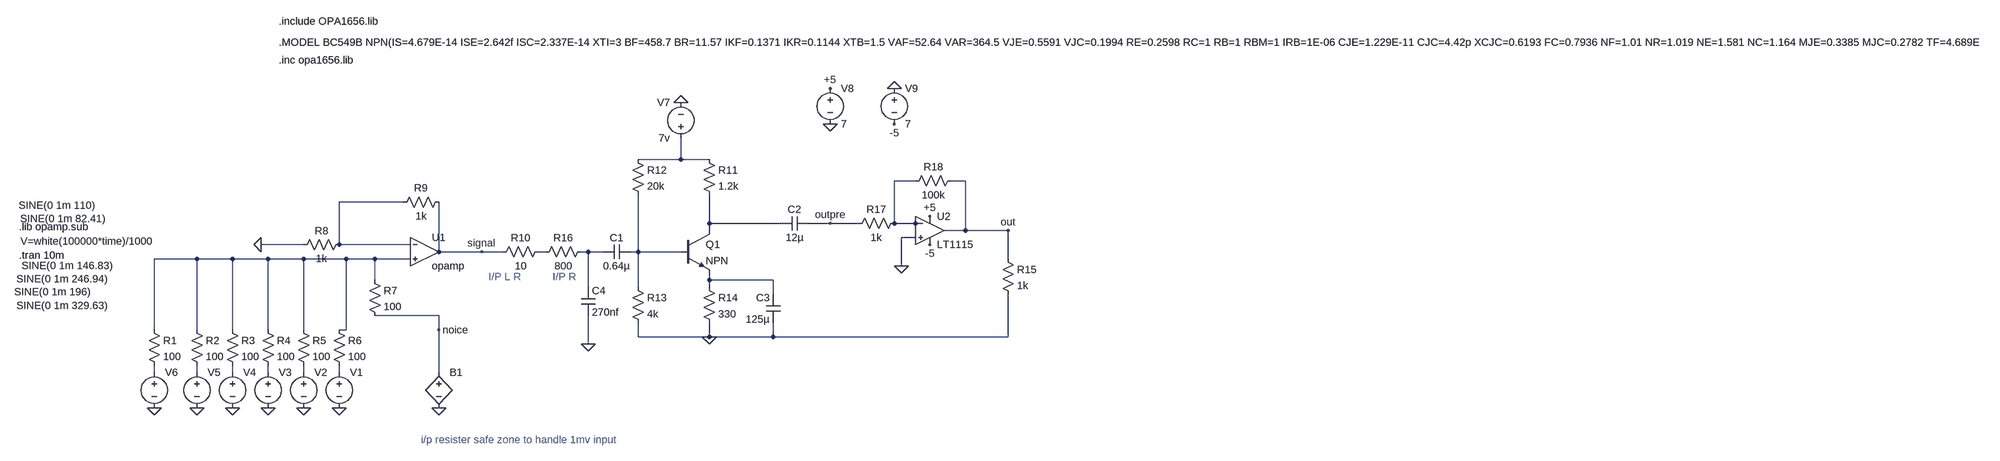
[diagram p0: schematic ADP.asc]
ADP.asc, the LTspice schematic file:
Version 4.1
SHEET 1 4832 680
WIRE 496 -320 496 -368
WIRE 496 -320 400 -320
WIRE 560 -320 496 -320
WIRE 1024 -272 976 -272
WIRE 1136 -272 1104 -272
WIRE -128 -224 -272 -224
WIRE 560 -176 560 -240
WIRE 720 -176 560 -176
WIRE 832 -176 784 -176
WIRE 896 -176 832 -176
WIRE 976 -176 976 -272
WIRE 1024 -176 976 -176
WIRE 1040 -176 1024 -176
WIRE 560 -160 560 -176
WIRE 1136 -160 1136 -272
WIRE 1136 -160 1088 -160
WIRE 1232 -160 1136 -160
WIRE 1024 -144 992 -144
WIRE -352 -128 -448 -128
WIRE -272 -128 -272 -224
WIRE -112 -128 -272 -128
WIRE -48 -112 -48 -224
WIRE 48 -112 -48 -112
WIRE 96 -112 48 -112
WIRE 192 -112 176 -112
WIRE 288 -112 272 -112
WIRE 320 -112 288 -112
WIRE 400 -112 400 -240
WIRE 400 -112 384 -112
WIRE 496 -112 400 -112
WIRE -592 -96 -688 -96
WIRE -512 -96 -592 -96
WIRE -432 -96 -512 -96
WIRE -352 -96 -432 -96
WIRE -256 -96 -352 -96
WIRE -192 -96 -256 -96
WIRE -112 -96 -192 -96
WIRE 1232 -96 1232 -160
WIRE 992 -80 992 -144
WIRE -192 -48 -192 -96
WIRE 560 -48 560 -64
WIRE 704 -48 560 -48
WIRE 288 -32 288 -112
WIRE 400 -32 400 -112
WIRE 560 -32 560 -48
WIRE 704 -16 704 -48
WIRE -48 32 -192 32
WIRE -688 64 -688 -96
WIRE -592 64 -592 -96
WIRE -512 64 -512 -96
WIRE -432 64 -432 -96
WIRE -352 64 -352 -96
WIRE -256 64 -256 -96
WIRE -256 64 -272 64
WIRE -48 64 -48 32
WIRE 400 80 400 48
WIRE 560 80 560 48
WIRE 560 80 400 80
WIRE 704 80 704 48
WIRE 704 80 560 80
WIRE 1232 80 1232 -16
WIRE 1232 80 704 80
WIRE 288 96 288 32
WIRE -688 160 -688 144
WIRE -592 160 -592 144
WIRE -512 160 -512 144
WIRE -432 160 -432 144
WIRE -352 160 -352 144
WIRE -272 160 -272 144
WIRE -48 160 -48 64
FLAG -48 240 0
FLAG -48 64 noice
FLAG -688 240 0
FLAG -592 240 0
FLAG -512 240 0
FLAG -432 240 0
FLAG -352 240 0
FLAG -272 240 0
FLAG -448 -128 0
FLAG 48 -112 signal
FLAG 496 -448 0
FLAG 560 80 0
FLAG 288 96 0
FLAG 832 -176 outpre
FLAG 992 -80 0
FLAG 832 -400 0
FLAG 976 -480 0
FLAG 832 -480 +5
FLAG 1056 -192 +5
FLAG 976 -400 -5
FLAG 1056 -128 -5
FLAG 1232 -160 out
SYMBOL bv -48 144 R0
WINDOW 3 -941 -280 Left 2
SYMATTR InstName B1
SYMATTR Value V=white(100000*time)/1000
SYMBOL voltage -272 144 R0
WINDOW 3 -718 -331 Left 2
WINDOW 123 0 0 Left 0
WINDOW 39 0 0 Left 0
SYMATTR InstName V1
SYMATTR Value SINE(0 1m 82.41)
SYMBOL voltage -352 144 R0
WINDOW 3 -641 -361 Left 2
WINDOW 123 0 0 Left 0
WINDOW 39 0 0 Left 0
SYMATTR InstName V2
SYMATTR Value SINE(0 1m 110)
SYMBOL voltage -432 144 R0
WINDOW 3 -554 -225 Left 2
WINDOW 123 0 0 Left 0
WINDOW 39 0 0 Left 0
SYMATTR InstName V3
SYMATTR Value SINE(0 1m 146.83)
SYMBOL voltage -512 144 R0
WINDOW 3 -491 -166 Left 2
WINDOW 123 0 0 Left 0
WINDOW 39 0 0 Left 0
SYMATTR InstName V4
SYMATTR Value SINE(0 1m 196)
SYMBOL voltage -592 144 R0
WINDOW 3 -406 -195 Left 2
WINDOW 123 0 0 Left 0
WINDOW 39 0 0 Left 0
SYMATTR InstName V5
SYMATTR Value SINE(0 1m 246.94)
SYMBOL voltage -688 144 R0
WINDOW 3 -310 -135 Left 2
WINDOW 123 0 0 Left 0
WINDOW 39 0 0 Left 0
SYMATTR InstName V6
SYMATTR Value SINE(0 1m 329.63)
SYMBOL res -704 48 R0
SYMATTR InstName R1
SYMATTR Value 100
SYMBOL res -608 48 R0
SYMATTR InstName R2
SYMATTR Value 100
SYMBOL res -528 48 R0
SYMATTR InstName R3
SYMATTR Value 100
SYMBOL res -448 48 R0
SYMATTR InstName R4
SYMATTR Value 100
SYMBOL res -368 48 R0
SYMATTR InstName R5
SYMATTR Value 100
SYMBOL res -288 48 R0
SYMATTR InstName R6
SYMATTR Value 100
SYMBOL OpAmps\\opamp -80 -176 R0
SYMATTR InstName U1
SYMBOL res -256 -144 R90
WINDOW 0 0 56 VBottom 2
WINDOW 3 32 56 VTop 2
SYMATTR InstName R8
SYMATTR Value 1k
SYMBOL res -32 -240 R90
WINDOW 0 0 56 VBottom 2
WINDOW 3 32 56 VTop 2
SYMATTR InstName R9
SYMATTR Value 1k
SYMBOL res -208 -64 R0
SYMATTR InstName R7
SYMATTR Value 100
SYMBOL res 544 -336 R0
SYMATTR InstName R11
SYMATTR Value 1.2k
SYMBOL res 384 -336 R0
SYMATTR InstName R12
SYMATTR Value 20k
SYMBOL res 384 -48 R0
SYMATTR InstName R13
SYMATTR Value 4k
SYMBOL res 544 -48 R0
SYMATTR InstName R14
SYMATTR Value 330
SYMBOL cap 384 -128 R90
WINDOW 0 0 32 VBottom 2
WINDOW 3 32 32 VTop 2
SYMATTR InstName C1
SYMATTR Value 0.64µ
SYMBOL cap 784 -192 R90
WINDOW 0 0 32 VBottom 2
WINDOW 3 32 32 VTop 2
SYMATTR InstName C2
SYMATTR Value 12µ
SYMBOL cap 720 48 R180
WINDOW 0 24 56 Left 2
WINDOW 3 24 8 Left 2
SYMATTR InstName C3
SYMATTR Value 125µ
SYMBOL voltage 496 -352 R180
WINDOW 0 24 96 Left 2
WINDOW 3 24 16 Left 2
WINDOW 123 0 0 Left 0
WINDOW 39 0 0 Left 0
SYMATTR InstName V7
SYMATTR Value 7v
SYMBOL res 192 -128 R90
WINDOW 0 0 56 VBottom 2
WINDOW 3 32 56 VTop 2
SYMATTR InstName R10
SYMATTR Value 10
SYMBOL res 288 -128 R90
WINDOW 0 0 56 VBottom 2
WINDOW 3 32 56 VTop 2
SYMATTR InstName R16
SYMATTR Value 800
SYMBOL npn 496 -160 R0
SYMATTR InstName Q1
SYMBOL cap 272 -32 R0
SYMATTR InstName C4
SYMATTR Value 270nf
SYMBOL res 992 -192 R90
WINDOW 0 0 56 VBottom 2
WINDOW 3 32 56 VTop 2
SYMATTR InstName R17
SYMATTR Value 1k
SYMBOL res 1120 -288 R90
WINDOW 0 0 56 VBottom 2
WINDOW 3 32 56 VTop 2
SYMATTR InstName R18
SYMATTR Value 100k
SYMBOL res 1216 -112 R0
SYMATTR InstName R15
SYMATTR Value 1k
SYMBOL voltage 832 -496 R0
WINDOW 123 0 0 Left 0
WINDOW 39 0 0 Left 0
SYMATTR InstName V8
SYMATTR Value 7
SYMBOL voltage 976 -496 R0
WINDOW 123 0 0 Left 0
WINDOW 39 0 0 Left 0
SYMATTR InstName V9
SYMATTR Value 7
SYMBOL OpAmps\\LT1115 1056 -224 R0
SYMATTR InstName U2
TEXT -992 -104 Left 2 !.tran 10m
TEXT -992 -168 Left 2 !.lib opamp.sub
TEXT 64 -56 Left 2 ;I/P L R
TEXT -88 312 Left 2 ;i/p resister safe zone to handle 1mv input
TEXT 208 -56 Left 2 ;I/P R
TEXT -408 -584 Left 2 !.MODEL BC549B NPN(IS=4.679E-14 ISE=2.642f ISC=2.337E-14 XTI=3 BF=458.7 BR=11.57 IKF=0.1371 IKR=0.1144 XTB=1.5 VAF=52.64 VAR=364.5 VJE=0.5591 VJC=0.1994 RE=0.2598 RC=1 RB=1 RBM=1 IRB=1E-06 CJE=1.229E-11 CJC=4.42p XCJC=0.6193 FC=0.7936 NF=1.01 NR=1.019 NE=1.581 NC=1.164 MJE=0.3385 MJC=0.2782 TF=4.689E-10 TR=1m2 ITF=0.8842 VTF=2.828 XTF=160 EG=1.11 VCEO=30 ICRATING=100m MFG=PHILIPS)
TEXT -408 -544 Left 2 !.inc opa1656.lib
TEXT -408 -632 Left 2 !.include OPA1656.lib

The netlist it stands for:
* ADP.asc
B1 noice 0 V=white(100000*time)/1000
V1 N015 0 SINE(0 1m 82.41)
V2 N014 0 SINE(0 1m 110)
V3 N013 0 SINE(0 1m 146.83)
V4 N012 0 SINE(0 1m 196)
V5 N011 0 SINE(0 1m 246.94)
V6 N010 0 SINE(0 1m 329.63)
R1 N008 N010 100
R2 N008 N011 100
R3 N008 N012 100
R4 N008 N013 100
R5 N008 N014 100
R6 N008 N015 100
X§U1 N003 N008 signal opamp Aol=100K GBW=10Meg  ; pins invin noninvin out
R8 N003 0 1k
R9 signal N003 1k
R7 N008 noice 100
R11 N001 N004 1.2k
R12 N001 N007 20k
R13 N007 0 4k
R14 N009 0 330
C1 N007 N006 0.64µ
C2 outpre N004 12µ
C3 0 N009 125µ
V7 N001 0 7v
R10 N005 signal 10
R16 N006 N005 800
Q1 N004 N007 N009 0 NPN
C4 N006 0 270nf
R17 N002 outpre 1k
R18 out N002 100k
R15 out 0 1k
V8 +5 0 7
V9 0 -5 7
X§U2 0 N002 +5 -5 out LT1028  ; LT1115, pins In+ In- V+ V- OUT
.model NPN NPN
.model PNP PNP
.lib standard.bjt
.tran 10m
.lib opamp.sub
* I/P L R
* i/p resister safe zone to handle 1mv input
* I/P R
.MODEL BC549B NPN(IS=4.679E-14 ISE=2.642f ISC=2.337E-14 XTI=3 BF=458.7 BR=11.57 IKF=0.1371 IKR=0.1144 XTB=1.5 VAF=52.64 VAR=364.5 VJE=0.5591 VJC=0.1994 RE=0.2598 RC=1 RB=1 RBM=1 IRB=1E-06 CJE=1.229E-11 CJC=4.42p XCJC=0.6193 FC=0.7936 NF=1.01 NR=1.019 NE=1.581 NC=1.164 MJE=0.3385 MJC=0.2782 TF=4.689E-10 TR=1m2 ITF=0.8842 VTF=2.828 XTF=160 EG=1.11 VCEO=30 ICRATING=100m MFG=PHILIPS)
.inc opa1656.lib
.include OPA1656.lib
.lib LTC.lib
.backanno
.end